# EasyEDA Pro project esp32s3_min_system.eprj

# Schematic Schematic1
Board Name: Board1; Create Date: 2025-03-25; Page Name: P1; Project Name: esp32s3_min_system; Schematic Name: Schematic1; Update Date: 2025-03-26; Company: EasyEDA.com; Page Size: A4; Version: V1.0
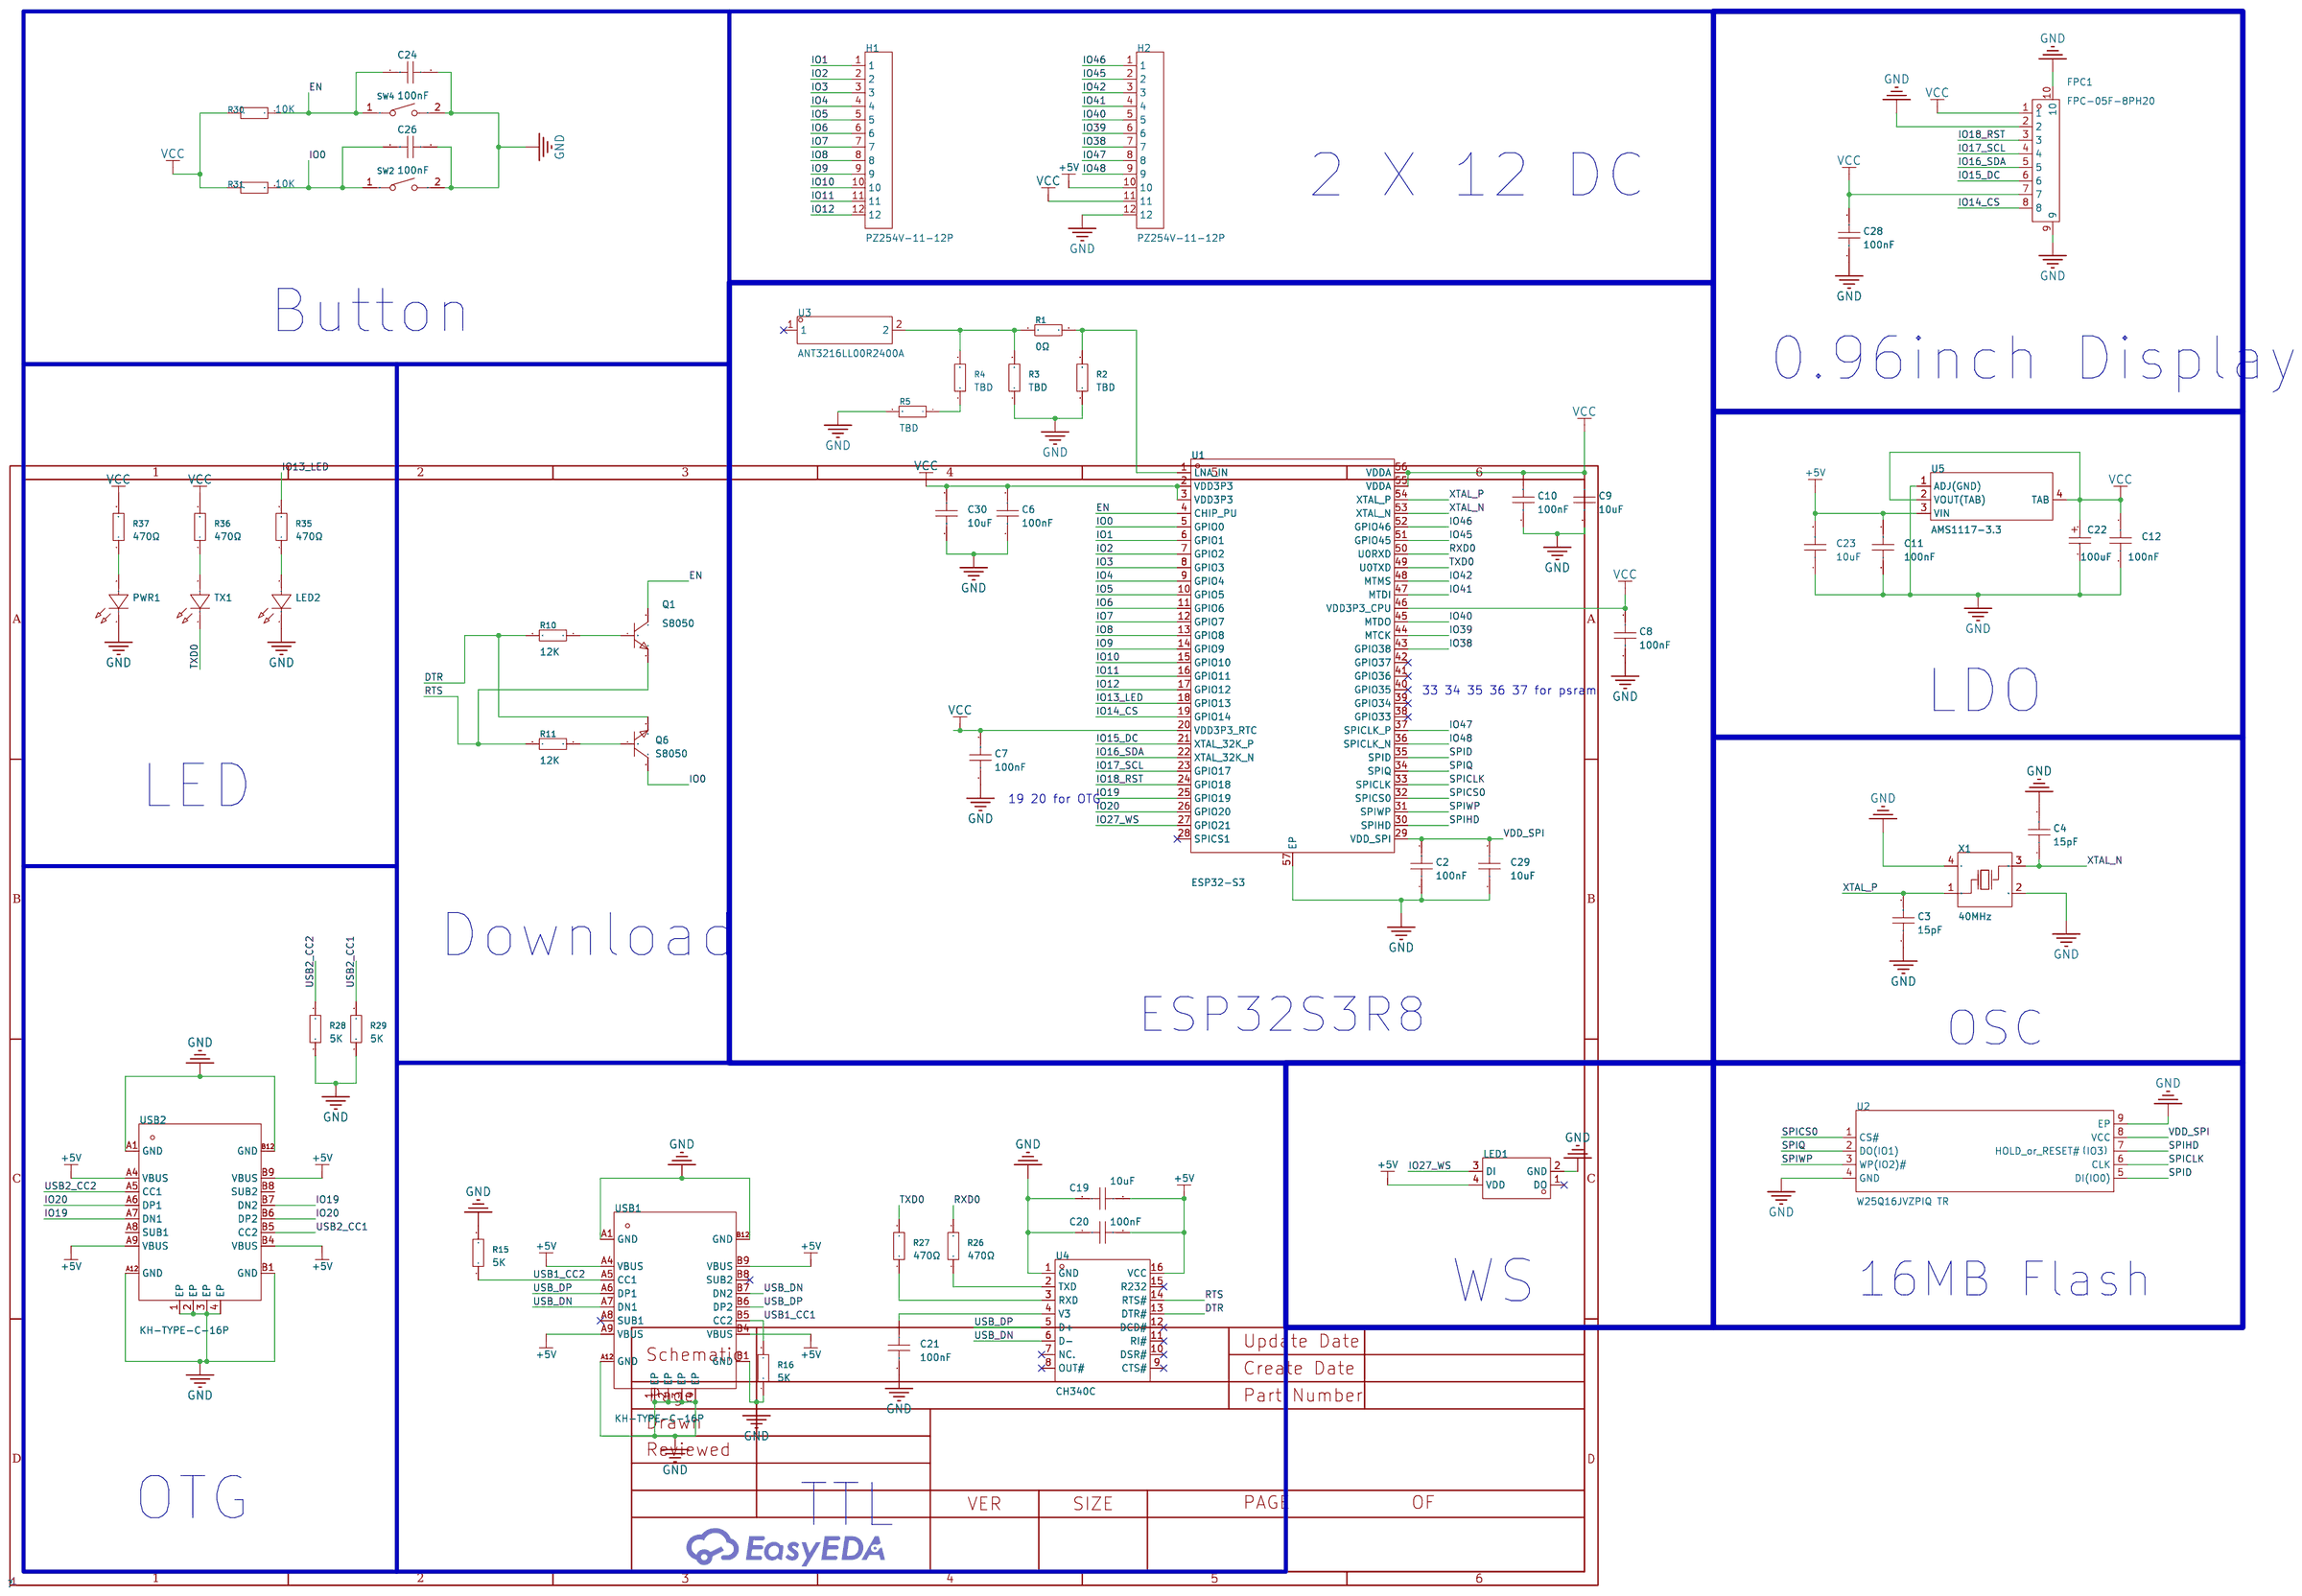
[diagram p0: schematic sheet]

## Parts
C2  100nF  [C0402]
C3  15pF  [C0402]
C4  15pF  [C0402]
C6  100nF  [C0402]
C7  100nF  [C0402]
C8  100nF  [C0402]
C9  10uF  [C0402]
C10  100nF  [C0402]
C11  100nF  [C0402]
C12  100nF  [C0402]
C19  10uF  [C0603]
C20  100nF  [C0402]
C21  100nF  [C0402]
C22  100uF  [CASE-B_3528]
C23  10uF  [C0603]
C24  100nF  [C0402]
C26  100nF  [C0402]
C28  100nF  [C0402]
C29  10uF  [C0603]
C30  10uF  [C0603]
FPC1  FPC-05F-8PH20  [FPC-SMD_8P-P0.50_FPC-05F-8PH20]
H1  PZ254V-11-12P  [HDR-TH_12P-P2.54-V-M]
H2  PZ254V-11-12P  [HDR-TH_12P-P2.54-V-M]
LED1  XL-2020RGBC-WS2812B  [LED-SMD_4P-L2.0-W2.0-BR-1]
LED2  XL-1608SURC-06  [LED0603-RD_RED]
PWR1  XL-1608SURC-06  [LED0603-RD_RED]
Q1  S8050  [SOT-23-3_L2.9-W1.3-P1.90-LS2.3-BR]
Q6  S8050  [SOT-23-3_L2.9-W1.3-P1.90-LS2.3-BR]
R1  0Ω  [R0402]
R2  TBD  [R0402]
R3  TBD  [R0402]
R4  TBD  [R0402]
R5  TBD  [R0402]
R10  12K  [R0402]
R11  12K  [R0402]
R15  5K  [R0402]
R16  5K  [R0402]
R26  470Ω  [R0402]
R27  470Ω  [R0402]
R28  5K  [R0402]
R29  5K  [R0402]
R30  10K  [R0402]
R31  10K  [R0402]
R35  470Ω  [R0402]
R36  470Ω  [R0402]
R37  470Ω  [R0402]
SW2  TS-1088-AR02016  [SW-SMD_L3.9-W3.0-P4.45]
SW4  TS-1088-AR02016  [SW-SMD_L3.9-W3.0-P4.45]
TX1  XL-1608SURC-06  [LED0603-RD_RED]
U1  ESP32-S3  [QFN-56_L7.0-W7.0-P0.40-TL-EP4.0]
U2  W25Q16JVZPIQ TR  [WSON-8_L6.0-W5.0-P1.27-BL-EP]
U3  ANT3216LL00R2400A  [ANT-SMD_L3.2-W1.6]
U4  CH340C  [SOP-16_L10.0-W3.9-P1.27-LS6.0-BL]
U5  AMS1117-3.3  [SOT-223-4_L6.5-W3.5-P2.30-LS7.0-BR]
USB1  KH-TYPE-C-16P  [USB-C-SMD_KH-TYPE-C-16P]
USB2  KH-TYPE-C-16P  [USB-C-SMD_KH-TYPE-C-16P]
X1  40MHz  [OSC-SMD_4P-L3.2-W2.5-BL_SIT8008BI]

## Library data of the parts
C2-C4 C6-C10 C28 = CL05A105KA5NQNC: LCSC Part Name: 1uF ±10% 25V; Supplier Part: C52923; Manufacturer: SAMSUNG(三星); Supplier Footprint: 0402; JLCPCB Part Class: Basic Part; Datasheet: https://atta.szlcsc.com/upload/public/pdf/source/20160218/1457707763339.pdf; Supplier: LCSC; Tolerance: ±10%
C11 C12 C20 C21 C24 C26 = CL05B104KO5NNNC: Capacitance: Tolerance:±10% Tolerance:±10% Voltage Rated: Temperature Coefficient:; LCSC Part Name: 100nF ±10% 16V; Supplier Part: C1525; Manufacturer: SAMSUNG(三星); Supplier Footprint: 0402; JLCPCB Part Class: Basic Part; Datasheet: https://atta.szlcsc.com/upload/public/pdf/source/20160218/1457707763339.pdf; Supplier: LCSC; Tolerance: ±10%
C19 C23 C29 C30 = CGA0603X5R106K100JT: Capacitance:10uF Tolerance:±10% Tolerance:±10% Voltage Rating:10V Temperature Coefficient:X5R; LCSC Part Name: 10uF ±10% 10V; Supplier Part: C6119842; Manufacturer: HRE(芯声); Supplier Footprint: 0603; JLCPCB Part Class: Extended Part; Supplier: LCSC; Tolerance: ±10%; Voltage Rating: 10V; Temperature Coefficient: X5R
C22 = TAJB107K006RNJ: Capacitance: Tolerance:±10% Tolerance:±10% Rated Voltage: Equivalent Series Resistance(ESR):1.7Ω@100kHz Operating Temperature:-55℃~+125℃ Operating Temperature:-55℃~+125℃; LCSC Part Name: 100uF ±10% 6.3V; Supplier Part: C16133; Manufacturer: Kyocera AVX; Supplier Footprint: CASE-B-3528-21(mm); JLCPCB Part Class: Basic Part; Datasheet: https://atta.szlcsc.com/upload/public/pdf/source/20160107/1457707750344.pdf; Supplier: LCSC; Tolerance: ±10%; Equivalent Series Resistance(ESR): 1.7Ω@100kHz; Operating Temperature: -55℃~+125℃
FPC1 = FPC-05F-8PH20: LCSC Part Name: 间距:0.5mm P数:8P 翻盖式 下接; Supplier Part: C2856797; Manufacturer: XUNPU(讯普); Supplier Footprint: SMD,P=0.5mm,卧贴; JLCPCB Part Class: Extended Part; Datasheet: https://atta.szlcsc.com/upload/public/pdf/source/20210728/C2856796_EA80EFD10E16055FE067E7763B90421F.pdf; Supplier: LCSC; Locking Feature: Clamshell; Contact Type: Bottom Contact; Number of Contacts: 8P; Pitch: 0.5mm; Mounting Type: 卧贴; FFC, FCB Thickness: 0.3mm; Height Above Board: 2mm; Operating Temperature Range: -25℃~+85℃
H1 H2 = PZ254V-11-12P: LCSC Part Name: 1x12P 间距:2.54mm 方针 直插; Supplier Part: C2840012; Manufacturer: XFCN(兴飞); Supplier Footprint: 插件,P=2.54mm; JLCPCB Part Class: Extended Part; Datasheet: https://atta.szlcsc.com/upload/public/pdf/source/20200309/C492403_F9F19131791D08044AD4F84F8E751A34.pdf; Supplier: LCSC; Pin Structure: 1x12P; Pitch: 2.54mm; Circluar Pins/Square Pins: Policy; Mounting Type: Straight; Number of Rows: Single Row; Number of Pins: 12P; Current Rating: 3A; Voltage Rating (Max): 250V; Length of Mating Pin: 6mm; Insulation Height: 2.5mm; Length of End Connection Pin: 3mm; Operating Temperature: -40℃~+105℃; Color: Black
LED1 = XL-2020RGBC-WS2812B: Wavelength:620nm~625nm；470nm~475nm；525nm~530nm Luminous Intensity:150mcd；150mcd；400mcd Lens Color:Translucent Fog Lens Installation method:Positive Stick Operating Temperature:-20℃~+85℃; LCSC Part Name: 幻彩透明; Supplier Part: C5349955; Manufacturer: XINGLIGHT(成兴光); Supplier Footprint: 2020; JLCPCB Part Class: Extended Part; Datasheet: https://atta.szlcsc.com/upload/public/pdf/source/20230111/97A2D5930F183799801175706AF118AF.pdf; Supplier: LCSC; Wavelength: 620nm~625nm；470nm~475nm；525nm~530nm; Luminous Intensity: 150mcd；150mcd；400mcd; Lens Color: Translucent Fog Lens; Installation method: Positive Stick; Operating Temperature: -20℃~+85℃
LED2 PWR1 TX1 = XL-1608SURC-06: Lamp Holder Type:- Illumination Color:Red Voltage - Forward(Vf):2.3V Voltage - Forward(Vf):2.3V Power(Watts):50mW Forward Current:20mA Wavelength - Dominant:620nm~630nm Wavelength - Dominant:620nm~630nm Peak Wavelength:625nm Diode Configuration:- Lens Col; Supplier Part: C965799; Manufacturer: XINGLIGHT(成兴光); Supplier Footprint: 0603; JLCPCB Part Class: Extended Part; Datasheet: https://atta.szlcsc.com/upload/public/pdf/source/20250213/F9766CE804AF391355DCDD48DB3E0DAB.pdf; Supplier: LCSC; Illumination Color: Red; Voltage - Forward(Vf): 2.3V; Power(Watts): 50mW; Forward Current: 20mA; Wavelength - Dominant: 620nm~630nm; Peak Wavelength: 625nm; Lens Color: Colorless Transparent Lens; Luminous Intensity: 225mcd; Viewing Angle: 120°; Mounting Sytle: Positive Stick; Operating Temperature: -20℃~+85℃
Q1 Q6 = S8050_C20069125: type:NPN Current - Collector(Ic): Collector - Emitter Voltage VCEO: Pd - Power Dissipation:300mW DC Current Gain:120@50mA,1.0V DC Current Gain:120@50mA,1.0V Transition frequency(fT):100MHz Current - Collector Cutoff:100nA Vce Saturation(VCE(sat)):600mV Op; LCSC Part Name: hFE:200-350，丝印:J3Y S8050; Supplier Part: C20069125; Manufacturer: 宏嘉诚; Supplier Footprint: SOT-23; JLCPCB Part Class: Extended Part; Datasheet: https://atta.szlcsc.com/upload/public/pdf/source/20250107/343E8B94B5C24D0D65D7D4B70E0B73F6.pdf; Supplier: LCSC; type: NPN; Pd - Power Dissipation: 300mW; DC Current Gain: 120@50mA,1.0V; Transition frequency(fT): 100MHz; Current - Collector Cutoff: 100nA; Vce Saturation(VCE(sat)): 600mV; Operating Temperature: -55℃~+150℃
R1-R5 = 0402WGF0000TCE: LCSC Part Name: 0Ω ±1% 62.5mW 厚膜电阻; Supplier Part: C17168; Manufacturer: UNI-ROYAL(厚声); Supplier Footprint: 0402; JLCPCB Part Class: Basic Part; Datasheet: https://atta.szlcsc.com/upload/public/pdf/source/20200306/C422600_1E6D84923E4A46A82E41ADD87F860B5C.pdf; Supplier: LCSC; Type: Thick Film Resistors; Tolerance: ±1%; Temperature Coefficient: ±800ppm/℃; Operating Temperature Range: -55℃~+155℃
R10 R11 R15 R16 R26-R31 R35-R37 = 0402WGF4700TCE: Type:Thick Film Resistors Resistance: Tolerance:±1% Tolerance:±1% Power(Watts): Overload Voltage (Max): Temperature Coefficient:±100ppm/℃ Temperature Coefficient:±100ppm/℃ Operating Temperature Range:-55℃~+155℃ Operating Temperature Range:-55℃~+155℃; LCSC Part Name: 470Ω ±1% 62.5mW 厚膜电阻; Supplier Part: C25117; Manufacturer: UNI-ROYAL(厚声); Supplier Footprint: 0402; JLCPCB Part Class: Basic Part; Datasheet: https://atta.szlcsc.com/upload/public/pdf/source/20200306/C422600_1E6D84923E4A46A82E41ADD87F860B5C.pdf; Supplier: LCSC; Type: Thick Film Resistors; Tolerance: ±1%; Temperature Coefficient: ±100ppm/℃; Operating Temperature Range: -55℃~+155℃
SW2 SW4 = TS-1088-AR02016: Circuit:SPST Actuator Style:Round Button Operating Force:160gf Mounting Style:Brick nogging Switch Length:4mm Switch Width:3mm Switch Height:2mm Strike Gundam:不带 Contact Current:50mA Voltage Rating (DC):12V Insulation Resistance:100MΩ Actuator/Cap Color:B; LCSC Part Name: 4*3*2mm 立贴 轻触开关; Supplier Part: C720477; Manufacturer: XUNPU(讯普); Supplier Footprint: SMD; JLCPCB Part Class: Extended Part; Datasheet: https://atta.szlcsc.com/upload/public/pdf/source/20200810/C720475_60D09DD6C54279ADDB2DC25100F1CC11.pdf; Supplier: LCSC; Circuit: SPST; Actuator Style: Round Button; Operating Force: 160gf; Mounting Style: Brick nogging; Switch Length: 4mm; Switch Width: 3mm; Switch Height: 2mm; Strike Gundam: 不带; Contact Current: 50mA; Voltage Rating (DC): 12V; Insulation Resistance: 100MΩ; Actuator/Cap Color: Black; Pin Style: SMDSplicing; Mechanical Life: 10万次; Operating Temperature: -30℃~+80℃
U1 = ESP32-S3: LCSC Part Name: 支持2.4GHz WIFI和低功耗蓝牙的MCU SoC; Supplier Part: C2913192; Manufacturer: ESPRESSIF(乐鑫); Supplier Footprint: QFN-56-EP(7x7); JLCPCB Part Class: Extended Part; Datasheet: https://atta.szlcsc.com/upload/public/pdf/source/20241030/3428D9BCA56E860957850BFAF37EAC62.pdf; Supplier: LCSC; Frequency Range: 2412MHz~2484MHz; Interface: ADC,GPIO,I2C,I2S,PWM,SPI,UART,USB; Operating Voltage: 3V~3.6V; Applications: WiFi；IoT; Output Power: 21dBm; Data Rate: 150Mbps; Current Of Transmitting: 340mA; Sensitivity: -98.4dBm; Receive Current: 88mA; Typical Application Frequency: 2.4GHz; Operating Temperature: -40℃~+105℃
U2 = W25Q16JVZPIQ TR: Supplier Part: C2456208; Manufacturer: WINBOND(华邦); Supplier Footprint: WSON-8-EP(5x6); JLCPCB Part Class: Extended Part; Datasheet: https://atta.szlcsc.com/upload/public/pdf/source/20190529/C115407_78E5B4F96E7138D299EC51EC5982A1A5.pdf; Supplier: LCSC
U3 = ANT3216LL00R2400A: LCSC Part Name: 无线组件陶瓷芯片天线; Supplier Part: C293767; Manufacturer: YAGEO(国巨); Supplier Footprint: 1206; JLCPCB Part Class: Extended Part; Datasheet: https://atta.szlcsc.com/upload/public/pdf/source/20181012/C293767_CDE82A2F74DC82A94DB708CB53B68F23.pdf; Supplier: LCSC; Antenna Type: Chip Antenna; Central Frequency: 2450MHz; Bandwidth: 160MHz; Peak Gain: 5.05dBi; Polarization Type: Linear; Impedance: 50Ω; Power capacity: 1W; Operating Temperature: -40℃~+105℃
U4 = CH340C: Applications Function:Transceiver Protocol: Supply Voltage:3.3V；5V Supply Voltage:3.3V；5V Data Rate:2Mbps; LCSC Part Name: CH340C USB转串口芯片 CH340; Supplier Part: C84681; Manufacturer: WCH(南京沁恒); Supplier Footprint: SOP-16; JLCPCB Part Class: Extended Part; Datasheet: https://atta.szlcsc.com/upload/public/pdf/source/20240619/63986D8440D4E5267A77ACD891CC4DE3.pdf; Supplier: LCSC; Applications Function: Transceiver; Supply Voltage: 3.3V；5V; Data Rate: 2Mbps
U5 = AMS1117-3.3_C347222: Output Type:Fixed Voltage - Supply:12V Output Voltage:3.3V Output Voltage:3.3V Output Current:1A Power Supply Rejection Ratio (PSRR):60dB@(120Hz) Voltage Dropout:1.3V@(1A) standby current:- Noise:- Features:Overcurrent Protection Operating Temperature:- O; LCSC Part Name: 输出:3.3V 电流:1A 耐压:12V; Supplier Part: C347222; Manufacturer: UMW(友台半导体); Supplier Footprint: SOT-223; JLCPCB Part Class: Extended Part; Datasheet: https://atta.szlcsc.com/upload/public/pdf/source/20241218/BAF0263FA2E44BCD8AF41AA4FA04EFAA.pdf; Supplier: LCSC; Output Type: Fixed; Voltage - Supply: 12V; Output Voltage: 3.3V; Output Current: 1A; Power Supply Rejection Ratio (PSRR): 60dB@(120Hz); Voltage Dropout: 1.3V@(1A); Features: Overcurrent Protection; Output Configuration: Positive electrode; Number of Outputs: 1
USB1 USB2 = KH-TYPE-C-16P: Connector Type:Type-C Standard:- Gender:Female Number of Ports:1 Number of Contacts:16P Mounting Style:卧贴 Current Rating - Power (Max):3A Operating Temperature Range:-40℃~+85℃ Operating Temperature Range:-40℃~+85℃; LCSC Part Name: Type-C 母 卧贴; Supplier Part: C709357; Manufacturer: kinghelm(金航标); Supplier Footprint: SMD; JLCPCB Part Class: Extended Part; Datasheet: https://atta.szlcsc.com/upload/public/pdf/source/20200911/C709357_AA8DCEB38BB20E3035A7ED7AE7667837.pdf; Supplier: LCSC; Connector Type: Type-C; Gender: Female; Number of Ports: 1; Number of Contacts: 16P; Mounting Style: 卧贴; Current Rating - Power (Max): 3A; Operating Temperature Range: -40℃~+85℃
X1 = X322540MPB4SI: LCSC Part Name: 40MHz ±10ppm 15pF; Supplier Part: C9010; Manufacturer: YXC(扬兴晶振); Supplier Footprint: SMD3225-4P; JLCPCB Part Class: Extended Part; Datasheet: https://atta.szlcsc.com/upload/public/pdf/source/20240329/19D5F850207469550BEB00D7DFEDBC7A.pdf; Supplier: LCSC; Crystal Type: Surface Mount Crystal; Normal temperature Frequency Tolerance: ±10ppm; Frequency Stability(Full temperature range): ±20ppm

## Nets
+5V: C11.1 C19.1 C20.2 C23.2 H2.10 LED1.4(VDD) U4.16(VCC) U5.3(VIN) USB1.A4(VBUS) USB1.A9(VBUS) USB1.B4(VBUS) USB1.B9(VBUS) USB2.A4(VBUS) USB2.A9(VBUS) USB2.B4(VBUS) USB2.B9(VBUS)
GND: C2.1 C3.1 C4.2 C6.1 C7.1 C8.1 C9.1 C10.1 C11.2 C12.2 C19.2 C20.1 C21.1 C22.2 C23.1 C24.2 C26.1 C28.1 C29.1 C30.1 FPC1.2 FPC1.9 FPC1.10 H2.12 LED1.2(GND) LED2.1(K) PWR1.1(K) R2.1 R3.1 R5.2 R15.2 R16.1 R28.1 R29.1 SW2.2 SW4.2 U1.57(EP) U2.4(GND) U2.9(EP) U4.1(GND) U5.1(ADJ(GND)) USB1.1(EP) USB1.2(EP) USB1.3(EP) USB1.4(EP) USB1.A1(GND) USB1.A12(GND) USB1.B1(GND) USB1.B12(GND) USB2.1(EP) USB2.2(EP) USB2.3(EP) USB2.4(EP) USB2.A1(GND) USB2.A12(GND) USB2.B1(GND) USB2.B12(GND) X1.2(GND) X1.4(GND)
VCC: C6.2 C7.2 C8.2 C9.2 C10.2 C12.1 C22.1 C28.2 C30.2 FPC1.1 FPC1.7 H2.11 R30.2 R31.2 R36.2 R37.2 U1.2(VDD3P3) U1.3(VDD3P3) U1.20(VDD3P3_RTC) U1.46(VDD3P3_CPU) U1.55(VDDA) U1.56(VDDA) U5.2(VOUT(TAB)) U5.4(TAB)
VDD_SPI: C2.2 C29.2 U1.29(VDD_SPI) U2.8(VCC)
DTR: Q6.2(E) R10.2 U4.13(DTR#)
EN: C24.1 Q1.3(C) R30.1 SW4.1 U1.4(CHIP_PU)
IO0: C26.2 Q6.3(C) R31.1 SW2.1 U1.5(GPIO0)
IO1: H1.1 U1.6(GPIO1)
IO2: H1.2 U1.7(GPIO2)
IO3: H1.3 U1.8(GPIO3)
IO4: H1.4 U1.9(GPIO4)
IO5: H1.5 U1.10(GPIO5)
IO6: H1.6 U1.11(GPIO6)
IO7: H1.7 U1.12(GPIO7)
IO8: H1.8 U1.13(GPIO8)
IO9: H1.9 U1.14(GPIO9)
IO10: H1.10 U1.15(GPIO10)
IO11: H1.11 U1.16(GPIO11)
IO12: H1.12 U1.17(GPIO12)
IO13_LED: R35.2 U1.18(GPIO13)
IO14_CS: FPC1.8 U1.19(GPIO14)
IO15_DC: FPC1.6 U1.21(XTAL_32K_P)
IO16_SDA: FPC1.5 U1.22(XTAL_32K_N)
IO17_SCL: FPC1.4 U1.23(GPIO17)
IO18_RST: FPC1.3 U1.24(GPIO18)
IO19: U1.25(GPIO19) USB2.A7(DN1) USB2.B7(DN2)
IO20: U1.26(GPIO20) USB2.A6(DP1) USB2.B6(DP2)
IO27_WS: LED1.3(DI) U1.27(GPIO21)
IO38: H2.7 U1.43(GPIO38)
IO39: H2.6 U1.44(MTCK)
IO40: H2.5 U1.45(MTDO)
IO41: H2.4 U1.47(MTDI)
IO42: H2.3 U1.48(MTMS)
IO45: H2.2 U1.51(GPIO45)
IO46: H2.1 U1.52(GPIO46)
IO47: H2.8 U1.37(SPICLK_P)
IO48: H2.9 U1.36(SPICLK_N)
RTS: Q1.2(E) R11.2 U4.14(RTS#)
RXD0: R26.2 U1.50(U0RXD)
SPICLK: U1.33(SPICLK) U2.6(CLK)
SPICS0: U1.32(SPICS0) U2.1(CS#)
SPID: U1.35(SPID) U2.5(DI(IO0))
SPIHD: U1.30(SPIHD) U2.7(HOLD or RESET#（IO3）)
SPIQ: U1.34(SPIQ) U2.2(DO(IO1))
SPIWP: U1.31(SPIWP) U2.3(WP(IO2)#)
TXD0: R27.2 TX1.1(K) U1.49(U0TXD)
USB1_CC1: R16.2 USB1.B5(CC2)
USB1_CC2: R15.1 USB1.A5(CC1)
USB2_CC1: R29.2 USB2.B5(CC2)
USB2_CC2: R28.2 USB2.A5(CC1)
USB_DN: U4.6(D-) USB1.A7(DN1) USB1.B7(DN2)
USB_DP: U4.5(D+) USB1.A6(DP1) USB1.B6(DP2)
XTAL_N: C4.1 U1.53(XTAL_N) X1.3(OSC2)
XTAL_P: C3.2 U1.54(XTAL_P) X1.1(OSC1)
$1N1315: R1.2 R2.2 U1.1(LNA_IN)
$1N1324: R1.1 R3.2 R4.2 U3.2
$1N1499: R4.1 R5.1
$1N3141: R26.1 U4.2(TXD)
$1N3142: R27.1 U4.3(RXD)
$1N3147: C21.2 U4.4(V3)
$1N3183: Q1.1(B) R10.1
$1N3184: Q6.1(B) R11.1
Net-(LED2-2): LED2.2(A) R35.1
Net-(PWR1-2): PWR1.2(A) R37.1
Net-(R36-1): R36.1 TX1.2(A)

Not connected (* = marked no-connect by the designer): LED1 1(DO)*; U1 28(SPICS1)* 38(GPIO33)* 39(GPIO34)* 40(GPIO35)* 41(GPIO36)* 42(GPIO37)*; U3 1*; U4 7(NC.)* 8(OUT#)* 9(CTS#)* 10(DSR#)* 11(RI#)* 12(DCD#)* 15(R232)*; USB1 A8(SUB1)* B8(SUB2)*; USB2 A8(SUB1) B8(SUB2)

## Notes on the sheet
- 2 X 12 DC
- Button
- 0.96inch Display
- 33 34 35 36 37 for psram
- LDO
- LED
- 19 20 for OTG
- Download
- ESP32S3R8
- OSC
- 16MB Flash
- WS
- OTG
- TTL

# Board PCB1
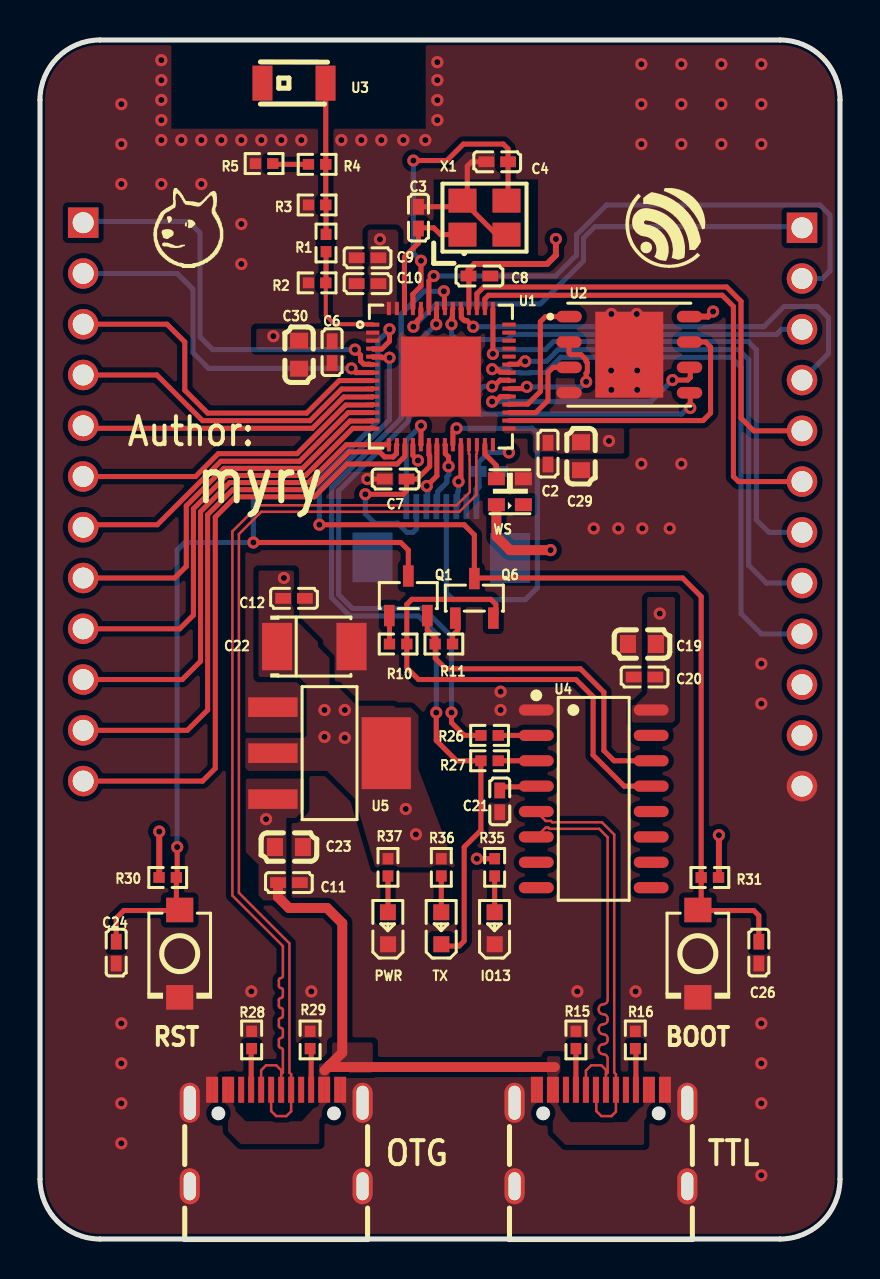
[diagram p1: board, top side]
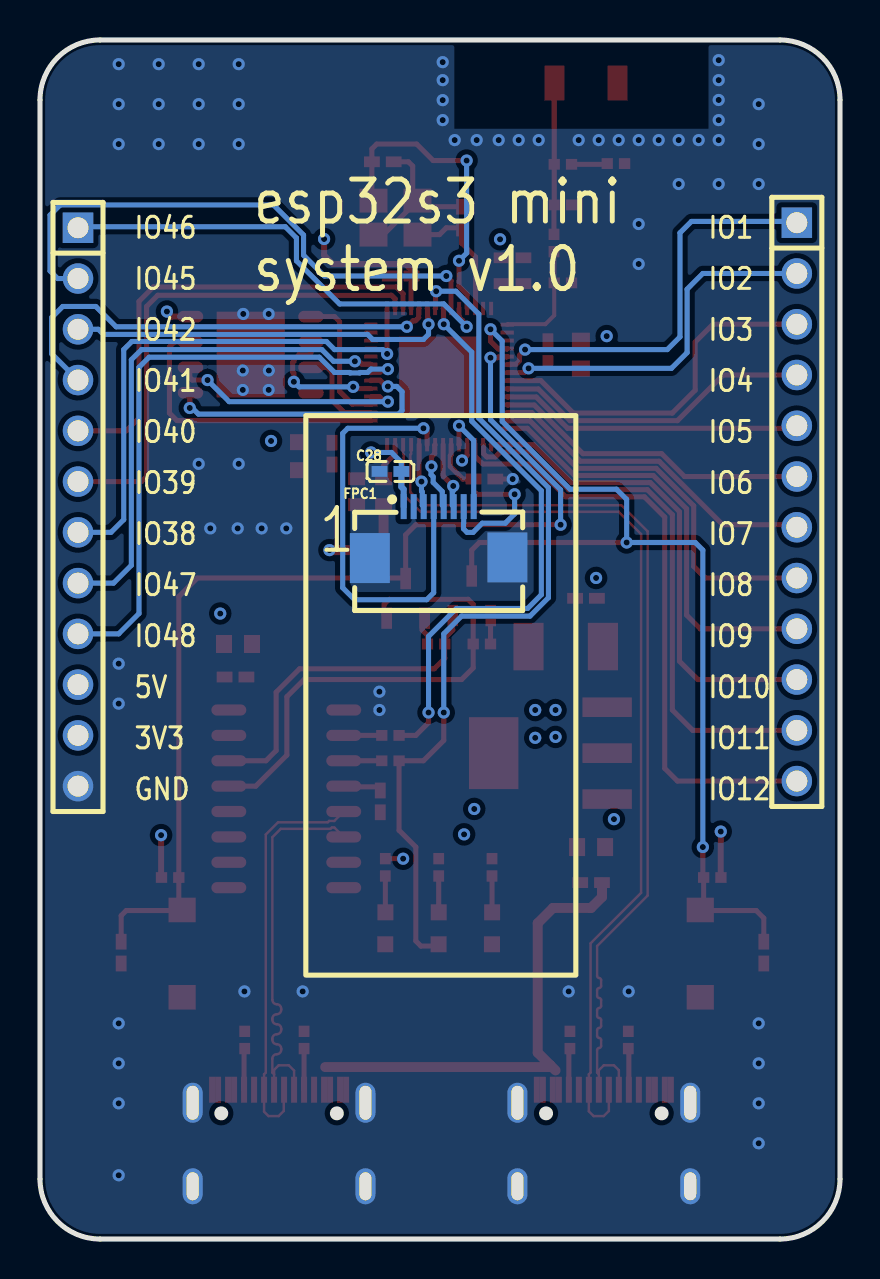
[diagram p2: board, bottom side, seen from below]

Outline 40 x 60 mm; copper layers: Top Layer, GND, PWR, Bottom Layer. Coordinates in mm from the lower left corner of the outline.
Outline path: 0,57 0,3 arc(0.88,0.88) 3,0 37,0 arc(39.12,0.88) 40,3 40,57 arc(39.12,59.12) 37,60 3,60 arc(0.88,59.12) 0,57
Stack: Top Layer 0.035mm Outer layer copper thickness 1oz / Dielectric1 0.2104mm 7628 RC49% 8.6mil / GND 0.0152mm Inner layer copper thickness / Dielectric2 1.065mm 1.1mm H/HOZ Copper / PWR 0.0152mm Inner layer copper thickness / Dielectric3 0.2104mm 7628 RC49% 8.6mil / Bottom Layer 0.035mm Outer layer copper thickness 1oz

## Design rules (mm)
net IO19: DP2
net IO20: DP2
net USB_DP: DP1
net USB_DN: DP1
template: Custom Config
spacing copperThickness1oz (default): track to track 0.102, other pairs 0.152 to 0.3
spacing copperThickness2oz: track to track 0.203, other pairs 0.152 to 0.3
track width copperThickness1oz (default): min 0.127, default 0.254, max 2.54
track width copperThickness2oz: min 0.203, default 0.254, max 2.54
differential pair differentialPair (default): width min 0.124, default 0.124, max 0.124; gap min 0.203, default 0.203
via viaSize (default): diameter min 0.5, default 0.61, max 10; hole min 0.3, default 0.305, max 6.3

## Placement (name value [footprint] x y rotation side)
BOOT  TS-1088-AR02016  [SW-SMD_L3.9-W3.0-P4.45]  32.89 14.28 270 top
C2  100nF  [C0402]  25.4 39.3 90 top
C3  15pF  [C0402]  18.92 51.11 270 top
C4  15pF  [C0402]  22.86 53.9 180 top
C6  100nF  [C0402]  14.6 44.38 90 top
C7  100nF  [C0402]  17.78 38.03 0 top
C8  100nF  [C0402]  21.97 48.19 180 top
C9  10uF  [C0402]  16.38 49.1 0 top
C10  100nF  [C0402]  16.38 47.81 0 top
C11  100nF  [C0402]  12.45 17.84 0 top
C12  100nF  [C0402]  12.7 32.06 0 top
C19  10uF  [C0603]  30.1 29.77 180 top
C20  100nF  [C0402]  30.23 28.12 0 top
C21  100nF  [C0402]  22.99 21.9 90 top
C22  100uF  [CASE-B_3528]  13.72 29.65 0 top
C23  10uF  [C0603]  12.45 19.61 180 top
C24  100nF  [C0402]  3.81 14.33 270 top
C26  100nF  [C0402]  35.94 14.33 90 top
C28  100nF  [C0402]  22.48 38.41 180 bottom
C29  10uF  [C0603]  27.05 39.17 90 top
C30  10uF  [C0603]  12.95 44.25 90 top
FPC1  FPC-05F-8PH20  [FPC-SMD_8P-P0.50_FPC-05F-8PH20]  20.07 35.36 180 bottom
H1  PZ254V-11-12P  [HDR-TH_12P-P2.54-V-M]  2.16 36.89 270 bottom
H2  PZ254V-11-12P  [HDR-TH_12P-P2.54-V-M]  38.1 36.63 270 bottom
IO13  XL-1608SURC-06  [LED0603-RD_RED]  22.73 15.55 90 top
OTG  KH-TYPE-C-16P  [USB-C-SMD_KH-TYPE-C-16P]  11.81 5.05 0 top
PWR  XL-1608SURC-06  [LED0603-RD_RED]  17.4 15.55 90 top
Q1  S8050  [SOT-23-3_L2.9-W1.3-P1.90-LS2.3-BR]  18.41 32.19 270 top
Q6  S8050  [SOT-23-3_L2.9-W1.3-P1.90-LS2.3-BR]  21.72 32.06 270 top
R1  0Ω  [R0402]  14.3 49.84 270 top
R2  TBD  [R0402]  13.86 47.85 0 top
R3  TBD  [R0402]  13.86 51.74 0 top
R4  TBD  [R0402]  13.86 53.78 0 top
R5  TBD  [R0402]  11.2 53.82 180 top
R10  12K  [R0402]  17.91 29.77 0 top
R11  12K  [R0402]  20.19 29.77 180 top
R15  5K  [R0402]  26.8 9.96 90 top
R16  5K  [R0402]  29.77 9.96 270 top
R26  470Ω  [R0402]  22.48 25.2 180 top
R27  470Ω  [R0402]  22.48 23.93 180 top
R28  5K  [R0402]  10.58 9.96 270 top
R29  5K  [R0402]  13.5 9.96 270 top
R30  10K  [R0402]  6.39 18.09 180 top
R31  10K  [R0402]  33.49 18.09 0 top
R35  470Ω  [R0402]  22.73 18.6 90 top
R36  470Ω  [R0402]  20.07 18.6 90 top
R37  470Ω  [R0402]  17.4 18.6 90 top
RST  TS-1088-AR02016  [SW-SMD_L3.9-W3.0-P4.45]  6.99 14.28 270 top
TTL  KH-TYPE-C-16P  [USB-C-SMD_KH-TYPE-C-16P]  28.05 5.05 0 top
TX  XL-1608SURC-06  [LED0603-RD_RED]  20.07 15.55 90 top
U1  ESP32-S3  [QFN-56_L7.0-W7.0-P0.40-TL-EP4.0]  20.04 43.16 0 top
U2  W25Q16JVZPIQ TR  [WSON-8_L6.0-W5.0-P1.27-BL-EP]  29.46 44.25 270 top
U3  ANT3216LL00R2400A  [ANT-SMD_L3.2-W1.6]  12.7 57.84 0 top
U4  CH340C  [SOP-16_L10.0-W3.9-P1.27-LS6.0-BL]  27.69 22.03 270 top
U5  AMS1117-3.3  [SOT-223-4_L6.5-W3.5-P2.30-LS7.0-BR]  14.48 24.31 180 top
WS  XL-2020RGBC-WS2812B  [LED-SMD_4P-L2.0-W2.0-BR-1]  23.5 37.39 0 top
X1  40MHz  [OSC-SMD_4P-L3.2-W2.5-BL_SIT8008BI]  22.22 51.11 0 top

## Footprints (pads in the part's own frame, mm; a bottom-side part is the same pattern mirrored in y, then rotated)
ANT-SMD_L3.2-W1.6
  rect 1x1.75 smd: 1(-1.578,0) 2(1.578,0)
C0402
  rect 0.79x0.54 smd: 1(-0.545,0) 2(0.545,0)
C0603
  rect 0.8x0.9 smd: 1(-0.7,0) 2(0.7,0)
CASE-B_3528
  rect 1.506x2.376 smd: 1(-1.861,0) 2(1.861,0)
FPC-SMD_8P-P0.50_FPC-05F-8PH20
  rect 0.3x1.25 smd: 1(-1.75,1.288) 2(-1.25,1.288) 3(-0.75,1.288) 4(-0.25,1.288) 5(0.25,1.288) 6(0.75,1.288) 7(1.25,1.288) 8(1.75,1.288)
  rect 2x2.5 smd: 9(3.44,-1.252) 10(-3.44,-1.288)
HDR-TH_12P-P2.54-V-M
  rect 1.524x1.524 hole 1.05: 1(-13.97,0)
  round 1.524 hole 1.05: 2(-11.43,0) 3(-8.89,0) 4(-6.35,0) 5(-3.81,0) 6(-1.27,0) 7(1.27,0) 8(3.81,0) 9(6.35,0) 10(8.89,0) 11(11.43,0) 12(13.97,0)
LED0603-RD_RED
  rect 0.8x0.8 smd: 1(-0.799,-0.004) 2(0.799,0.004)
LED-SMD_4P-L2.0-W2.0-BR-1
  rect 0.85x0.65 smd: 1(0.675,-0.65) 2(0.675,0.65) 3(-0.675,0.65) 4(-0.675,-0.65)
OSC-SMD_4P-L3.2-W2.5-BL_SIT8008BI
  rect 1.4x1.2 smd: 1(-1.1,-0.85) 2(1.1,-0.85) 3(1.1,0.85) 4(-1.1,0.85)
QFN-56_L7.0-W7.0-P0.40-TL-EP4.0
  rect 0.665x0.2 smd: 1(-3.408,2.6) 2(-3.408,2.2) 3(-3.408,1.8) 4(-3.408,1.4) 5(-3.408,1) 6(-3.408,0.6) 7(-3.408,0.2) 8(-3.408,-0.2) 9(-3.408,-0.6) 10(-3.408,-1) 11(-3.408,-1.4) 12(-3.408,-1.8) 13(-3.408,-2.2) 14(-3.408,-2.6) 29(3.408,-2.6) 30(3.408,-2.2) 31(3.408,-1.8) 32(3.408,-1.4) 33(3.408,-1) 34(3.408,-0.6) 35(3.408,-0.2) 36(3.408,0.2) 37(3.408,0.6) 38(3.408,1) 39(3.408,1.4) 40(3.408,1.8) 41(3.408,2.2) 42(3.408,2.6)
  rect 0.2x0.665 smd: 15(-2.6,-3.408) 16(-2.2,-3.408) 17(-1.8,-3.408) 18(-1.4,-3.408) 19(-1,-3.408) 20(-0.6,-3.408) 21(-0.2,-3.408) 22(0.2,-3.408) 23(0.6,-3.408) 24(1,-3.408) 25(1.4,-3.408) 26(1.8,-3.408) 27(2.2,-3.408) 28(2.6,-3.408) 43(2.6,3.408) 44(2.2,3.408) 45(1.8,3.408) 46(1.4,3.408) 47(1,3.408) 48(0.6,3.408) 49(0.2,3.408) 50(-0.2,3.408) 51(-0.6,3.408) 52(-1,3.408) 53(-1.4,3.408) 54(-1.8,3.408) 55(-2.2,3.408) 56(-2.6,3.408)
  rect 4x4 smd: 57(0,0)
R0402
  rect 0.566x0.54 smd: 1(-0.433,0) 2(0.433,0)
SOP-16_L10.0-W3.9-P1.27-LS6.0-BL
  oval 0.56x1.745 smd: 1(-4.445,-2.873) 2(-3.175,-2.873) 3(-1.905,-2.873) 4(-0.635,-2.873) 5(0.635,-2.873) 6(1.905,-2.873) 7(3.175,-2.873) 8(4.445,-2.873) 9(4.445,2.873) 10(3.175,2.873) 11(1.905,2.873) 12(0.635,2.873) 13(-0.635,2.873) 14(-1.905,2.873) 15(-3.175,2.873) 16(-4.445,2.873)
SOT-23-3_L2.9-W1.3-P1.90-LS2.3-BR
  rect 1.07x0.532 smd: 1(0.99,-0.95) 2(0.99,0.95) 3(-0.99,0)
SOT-223-4_L6.5-W3.5-P2.30-LS7.0-BR
  rect 2.47x0.98 smd: 1(2.835,-2.3) 2(2.835,0) 3(2.835,2.3)
  rect 2.47x3.6 smd: 4(-2.835,0)
SW-SMD_L3.9-W3.0-P4.45
  rect 1.23x1.36 smd: 1(-2.185,0) 2(2.185,0)
USB-C-SMD_KH-TYPE-C-16P
  oval 1x2 hole 0.6x1.7: 1(-4.32,1.765) 2(4.32,1.765)
  oval 1x1.8 hole 0.6x1.4: 3(-4.32,-2.415) 4(4.32,-2.415)
  rect 0.3x1.3 smd: A1(-3.35,2.415) A4(-2.55,2.415) A5(-1.25,2.415) A6(-0.25,2.415) A7(0.25,2.415) A8(1.25,2.415) A9(2.55,2.415) A12(3.35,2.415) B1(3.05,2.415) B4(2.25,2.415) B5(1.75,2.415) B6(0.75,2.415) B7(-0.75,2.415) B8(-1.75,2.415) B9(-2.25,2.415) B12(-3.05,2.415)
WSON-8_L6.0-W5.0-P1.27-BL-EP
  oval 0.581x1.276 smd: 1(-1.905,-3.013) 2(-0.635,-3.013) 3(0.635,-3.013) 4(1.905,-3.013) 5(1.905,3.013) 6(0.635,3.013) 7(-0.635,3.013) 8(-1.905,3.013)
  rect 4.3x3.4 smd: 9(0,0)

## Nets
+5V: C11.1 C19.1 C20.2 C23.2 H2.10 OTG.A4 OTG.A9 OTG.B4 OTG.B9 TTL.A4 TTL.A9 TTL.B4 TTL.B9 U4.16 U5.3 WS.4
GND: BOOT.2 C2.1 C3.1 C4.2 C6.1 C7.1 C8.1 C9.1 C10.1 C11.2 C12.2 C19.2 C20.1 C21.1 C22.2 C23.1 C24.2 C26.1 C28.1 C29.1 C30.1 FPC1.2 FPC1.9 FPC1.10 H2.12 IO13.1 OTG.1 OTG.2 OTG.3 OTG.4 OTG.A1 OTG.A12 OTG.B1 OTG.B12 PWR.1 R2.1 R3.1 R5.2 R15.2 R16.1 R28.1 R29.1 RST.2 TTL.1 TTL.2 TTL.3 TTL.4 TTL.A1 TTL.A12 TTL.B1 TTL.B12 U1.57 U2.4 U2.9 U4.1 U5.1 WS.2 X1.2 X1.4
VCC: C6.2 C7.2 C8.2 C9.2 C10.2 C12.1 C22.1 C28.2 C30.2 FPC1.1 FPC1.7 H2.11 R30.2 R31.2 R36.2 R37.2 U1.2 U1.3 U1.20 U1.46 U1.55 U1.56 U5.2 U5.4
VDD_SPI: C2.2 C29.2 U1.29 U2.8
DTR: Q6.2 R10.2 U4.13
EN: C24.1 Q1.3 R30.1 RST.1 U1.4
IO0: BOOT.1 C26.2 Q6.3 R31.1 U1.5
IO1: H1.1 U1.6
IO2: H1.2 U1.7
IO3: H1.3 U1.8
IO4: H1.4 U1.9
IO5: H1.5 U1.10
IO6: H1.6 U1.11
IO7: H1.7 U1.12
IO8: H1.8 U1.13
IO9: H1.9 U1.14
IO10: H1.10 U1.15
IO11: H1.11 U1.16
IO12: H1.12 U1.17
IO13_LED: R35.2 U1.18
IO14_CS: FPC1.8 U1.19
IO15_DC: FPC1.6 U1.21
IO16_SDA: FPC1.5 U1.22
IO17_SCL: FPC1.4 U1.23
IO18_RST: FPC1.3 U1.24
IO19: OTG.A7 OTG.B7 U1.25
IO20: OTG.A6 OTG.B6 U1.26
IO27_WS: U1.27 WS.3
IO38: H2.7 U1.43
IO39: H2.6 U1.44
IO40: H2.5 U1.45
IO41: H2.4 U1.47
IO42: H2.3 U1.48
IO45: H2.2 U1.51
IO46: H2.1 U1.52
IO47: H2.8 U1.37
IO48: H2.9 U1.36
RTS: Q1.2 R11.2 U4.14
RXD0: R26.2 U1.50
SPICLK: U1.33 U2.6
SPICS0: U1.32 U2.1
SPID: U1.35 U2.5
SPIHD: U1.30 U2.7
SPIQ: U1.34 U2.2
SPIWP: U1.31 U2.3
TXD0: R27.2 TX.1 U1.49
USB1_CC1: R16.2 TTL.B5
USB1_CC2: R15.1 TTL.A5
USB2_CC1: OTG.B5 R29.2
USB2_CC2: OTG.A5 R28.2
USB_DN: TTL.A7 TTL.B7 U4.6
USB_DP: TTL.A6 TTL.B6 U4.5
XTAL_N: C4.1 U1.53 X1.3
XTAL_P: C3.2 U1.54 X1.1
$1N1315: R1.2 R2.2 U1.1
$1N1324: R1.1 R3.2 R4.2 U3.2
$1N1499: R4.1 R5.1
$1N3141: R26.1 U4.2
$1N3142: R27.1 U4.3
$1N3147: C21.2 U4.4
$1N3183: Q1.1 R10.1
$1N3184: Q6.1 R11.1
$1N4334: PWR.2 R37.1
$1N4335: R36.1 TX.2
$1N4336: IO13.2 R35.1

Pads without a net: OTG A8 B8; TTL A8 B8; U1 28 38 39 40 41 42; U3 1; U4 7 8 9 10 11 12 15; WS 1

## Via types
v1: diameter 0.61, hole 0.305, Top Layer to Bottom Layer, 121 vias

## Routing (per net, layer and track width the routed paths; a pad name or vN(x,y) marks a point on that pad's centre or on a via; arc(x,y) is an arc through that point)
+5V: length 70.9
  Top Layer w0.5: v1(25.53,34.47) 23.5,34.47 22.82,35.15 WS.4 ; 14.48,8.69 15.11,9.33 15.11,15.8 14.35,16.57 12.45,16.57 11.9,17.11 C11.1 ; 14.48,8.69 14.22,8.44 ; 14.48,8.69 14.56,8.61 25.74,8.61
  PWR w0.5: H2.10 34.56,27.74 33.6,28.71 33.6,30.31 32.61,31.3 v1(30.99,31.3) 30.99,33.26 29.77,34.47 v1(25.53,34.47) 25.55,34.45 25.55,32.82 23.77,31.04 13.48,31.04 11.3,28.87 v1(11.3,21.01)
GND: length 9
  Top Layer w0.254: C7.1 v1(16.37,38.03) ; X1.4 22.82,50.26 X1.2 ; X1.4 20.82,51.65 C3.1 ; X1.4 21.37,52.2 21.37,53.69 21.58,53.9 22.31,53.9
  vias: v1(4.07,56.79) v1(4.07,54.79) v1(4.07,52.79) v1(4.07,10.79) v1(4.07,8.79) v1(4.07,6.79) v1(4.07,4.79) v1(6.07,58.99) v1(6.07,57.99) v1(6.07,57) v1(6.07,55.99) v1(6.07,54.99) v1(6.07,52.79) v1(7.07,54.99) v1(8.07,54.99) v1(8.07,52.79) v1(9.07,54.99) v1(10.07,54.99) v1(10.07,50.79) v1(10.07,48.79) v1(10.57,12.39) v1(11.07,54.99) v1(12.07,54.99) v1(13.07,54.99) v1(13.57,12.39) v1(15.07,54.99) v1(16.07,54.99) v1(17.07,54.99) v1(18.17,54.99) v1(19.27,54.99) v1(19.87,58.89) v1(19.87,57.99) v1(19.87,56.99) v1(19.87,55.99) v1(23.03,27.39) v1(23.03,26.47) v1(26.87,12.39) v1(27.69,35.56) v1(28.57,46.29) v1(28.56,43.46) v1(28.57,42.49) v1(28.92,35.56) v1(29.78,12.39) v1(29.84,46.29) v1(29.86,43.46) v1(29.86,42.49) v1(30.07,58.79) v1(30.07,56.79) v1(30.07,54.79) v1(30.07,38.79) v1(30.12,35.56) v1(31.49,35.56) v1(32.07,58.79) v1(32.07,56.79) v1(32.07,54.79) v1(32.07,38.79) v1(34.07,58.79) v1(34.07,56.79) v1(34.07,54.79) v1(36.07,58.79) v1(36.07,56.79) v1(36.07,54.79) v1(36.07,28.79) v1(36.07,26.79) v1(36.07,10.79) v1(36.07,8.79) v1(36.07,6.79) v1(36.07,3.19)
VCC: length 110
  Top Layer w0.254: U1.20 19.44,39.24 19.48,39.2 19.48,38.66 18.85,38.03 C7.2 18.32,37.43 18.16,37.27 v1(16.27,37.27) ; C8.2 21.44,48.17 U1.46
  Top Layer w0.3: R31.2 33.95,18.11 v1(33.95,20.21) ; R30.2 5.96,18.1 v1(5.96,20.39) ; C8.2 21.43,48.49 21.73,48.79 25.36,48.79 25.8,49.23 v1(25.8,50.04)
  PWR w0.254: v1(12.2,33.08) 12.56,33.44 15.66,33.44 16.27,34.05 v1(16.27,37.27)
  PWR w0.3: v1(5.96,20.39) 13.55,20.39 14.22,21.07 v1(14.22,25.13) ; v1(18.8,20.25) 18.84,20.21 v1(33.95,20.21) 33.95,24.6 34.55,25.2 H2.11 ; v1(25.8,50.04) 17.01,50.04 v1(17,50.03) 16.98,50.04 12.45,50.04 11.67,49.26 v1(11.67,45.18) 11.67,38.32 12.75,37.24 16.24,37.24 v1(16.27,37.27) 16.46,37.08 22.68,37.08 23.45,37.84 v1(23.45,39.36)
  Bottom Layer w0.254: v1(23.45,39.36) 22.43,39.36 21.93,38.87 C28.2 ; FPC1.7 18.82,35.8 18.83,35.79 18.83,35.54 18.65,35.36 18.35,35.36 17.89,35.82 16.74,35.82 16.27,36.29 v1(16.27,37.27)
  Bottom Layer w0.3: FPC1.1 21.82,37.52 21.93,37.64 C28.2
  vias: v1(14.22,26.47) v1(15.24,26.47) v1(15.24,25.08) v1(18.29,21.52)
VDD_SPI: length 12.7
  Top Layer w0.3: U2.8 33.4,46.16 v1(33.66,46.41)
  PWR w0.3: v1(33.66,46.41) 33.66,40.31 33.27,39.93 v1(28.45,39.93)
DTR: length 24.8
  Top Layer w0.254: U4.13 29.21,22.66 27.66,24.22 27.66,27.14 26.8,28 18.92,28 18.34,28.58 R10.2 18.34,31.76 18.59,32.01 22.54,32.01 22.79,31.76 22.79,31.2
EN: length 52.2
  Top Layer w0.254: Q1.3 18.41,34.47 18.03,34.85 v1(10.67,34.85) ; v1(17.47,45.52) 17.47,44.92 17.09,44.53 16.66,44.53 U1.4 ; v1(6.86,19.61) 6.86,18.13 R30.1 6.82,16.63 RST.1 6.96,16.44 4.19,16.44 3.81,16.06 C24.1
  Bottom Layer w0.254: v1(17.47,45.52) 16.89,44.94 16.89,40.91 13.5,37.52 11.18,37.52 10.67,37.01 v1(10.67,34.85) 7.24,34.85 6.86,34.47 v1(6.86,19.61)
IO0: length 52.7
  Top Layer w0.254: v1(13.97,35.74) 21.21,35.74 21.72,35.23 Q6.3 21.74,33.08 32.13,33.08 33.06,32.15 R31.1 33.06,16.63 ; 33.06,16.63 33.25,16.44 35.69,16.44 35.94,16.18 C26.2 ; 33.06,16.63 BOOT.1 ; U1.5 16.66,44.13 17.09,44.13 17.12,44.1 v1(17.47,44.1)
  Bottom Layer w0.254: v1(13.97,35.74) 13.97,37.49 17.47,41 v1(17.47,44.1)
IO1: length 20.7
  Top Layer w0.254: U1.6 16.5,43.76 16.48,43.78 16.19,43.78 16.03,43.94 16.03,44.23 v1(15.75,44.51)
  Bottom Layer w0.254: H1.1 2.22,50.92 7.43,50.92 8,50.35 8,45.14 8.64,44.51 v1(15.75,44.51)
IO2: length 18.4
  Top Layer w0.254: U1.7 15.78,43.36 v1(15.57,43.57)
  Bottom Layer w0.254: v1(15.57,43.57) 8.43,43.57 7.65,44.35 7.65,47.53 6.86,48.32 H1.2
IO3: length 18.4
  Top Layer w0.254: H1.3 6.35,45.78 7.24,44.89 7.24,42.47 8.38,41.33 13.34,41.33 14.96,42.96 U1.8
IO4: length 16.1
  Top Layer w0.254: U1.9 16.62,42.53 15.08,42.53 13.5,40.95 8.13,40.95 5.84,43.24 H1.4
IO5: length 15.2
  Top Layer w0.254: H1.5 2.29,40.57 13.62,40.57 15.19,42.13 16.62,42.13 U1.10
IO6: length 16
  Top Layer w0.254: H1.6 7.77,38.16 8.92,39.3 12.85,39.3 15.29,41.73 16.62,41.73 U1.11
IO7: length 16.9
  Top Layer w0.254: H1.7 2.29,35.74 5.86,35.74 9.04,38.92 12.98,38.92 15.41,41.36 U1.12
IO8: length 19.5
  Top Layer w0.254: H1.8 6.73,33.08 7.31,33.66 7.31,36.69 9.19,38.56 13.13,38.56 15.5,40.93 16.62,40.93 U1.13
IO9: length 21.8
  Top Layer w0.254: H1.9 6.99,30.54 7.67,31.22 7.67,36.54 9.34,38.21 13.27,38.21 15.63,40.57 16.62,40.57 U1.14
IO10: length 24.5
  Top Layer w0.254: U1.15 15.32,39.75 13.42,37.85 9.48,37.85 8.03,36.39 8.03,28.91 7.11,28 H1.10
IO11: length 27.8
  Top Layer w0.254: H1.11 7.37,25.46 8.38,26.47 8.38,36.25 9.63,37.5 13.57,37.5 15.46,39.39 16.98,39.39 17.23,39.14 17.66,39.14 17.82,39.3 17.82,39.73 U1.16
IO12: length 30.8
  Top Layer w0.254: U1.17 18.24,39.17 17.86,38.78 15.36,38.78 13.72,37.14 9.78,37.14 8.76,36.12 8.76,23.55 8.13,22.92 H1.12
IO13_LED: length 24.9
  Top Layer w0.254: v1(18.9,38.96) 18.64,39.21 U1.18 ; 22.73,19.03 v1(21.84,19.03)
  GND w0.254: v1(21.84,19.03) 21.84,38.92 21.46,39.3 19.24,39.3 v1(18.9,38.96)
IO14_CS: length 5.3
  Top Layer w0.254: v1(19.05,40.7) 19.05,39.75 U1.19
  Bottom Layer w0.254: v1(19.05,40.7) 18.32,39.96 FPC1.8
IO15_DC: length 3.4
  Top Layer w0.254: U1.21 19.84,38.19 v1(19.34,37.68)
  Bottom Layer w0.254: v1(19.34,37.68) 19.34,37.44 19.39,37.39 19.39,36.72 FPC1.6
IO16_SDA: length 3.4
  Top Layer w0.254: U1.22 20.27,39.73 20.27,39.3 20.43,39.14 v1(20.43,38.66)
  Bottom Layer w0.254: v1(20.43,38.66) 20.45,38.65 20.45,38.25 20.34,38.14 20.34,37.86 19.89,37.4 19.89,36.72 FPC1.5
IO17_SCL: length 22
  Top Layer w0.254: U1.23 20.64,40.39 v1(20.83,40.57)
  Bottom Layer w0.254: v1(20.83,40.57) 24.61,40.57 24.87,40.31 24.87,32.59 24.27,31.99 20.67,31.99 20.32,32.34 FPC1.4
IO18_RST: length 3.2
  Top Layer w0.254: U1.24 21.04,38.02 v1(20.93,37.9)
  Bottom Layer w0.254: FPC1.3 20.89,36.72 20.89,37.39 20.93,37.43 v1(20.93,37.9)
IO19: length 47.4
  Top Layer w0.124: 12.06,8.25 12.06,8.44 11.81,8.69 11.3,8.69 11.06,8.45 OTG.B7 ; 12.06,8.25 12.14,8.33 12.14,9.46 arc(12.11,9.53) 12.04,9.56 arc(11.97,9.59) 11.94,9.66 11.94,9.96 arc(11.97,10.03) 12.04,10.06 arc(12.11,10.09) 12.14,10.16 12.14,10.46 arc(12.11,10.53) 12.04,10.56 arc(11.97,10.59) 11.94,10.66 11.94,10.96 arc(11.97,11.03) 12.04,11.06 arc(12.11,11.09) 12.14,11.16 12.14,11.46 arc(12.11,11.53) 12.04,11.56 arc(11.97,11.59) 11.94,11.66 11.94,11.96 arc(11.97,12.03) 12.04,12.06 arc(12.11,12.09) 12.14,12.16 12.14,12.46 arc(12.11,12.53) 12.04,12.56 arc(11.97,12.59) 11.94,12.66 11.94,12.96 arc(11.97,13.03) 12.04,13.06 arc(12.11,13.09) 12.14,13.16 12.14,14.66 9.62,17.19 9.62,35.41 10.93,36.72 20.83,36.72 21.49,37.37 21.49,38.99 21.48,39 21.48,39.26 21.44,39.29 U1.25 ; 12.06,8.25 12.06,8.24 OTG.A7
IO20: length 47.4
  Top Layer w0.124: U1.26 21.84,39.29 21.81,39.26 21.81,39.13 21.81,39.13 21.81,37.24 20.97,36.39 11.06,36.39 9.95,35.27 9.95,17.32 12.47,14.8 12.47,8.33 12.56,8.24 OTG.B6 12.56,6.39 12.32,6.15 11.81,6.15 11.56,6.41 11.56,7.47
IO27_WS: length 1.9
  Top Layer w0.254: WS.3 22.82,38.7 22.24,39.28 U1.27
IO38: length 26.9
  Top Layer w0.254: U1.43 v1(22.64,44.29)
  Bottom Layer w0.254: v1(22.64,44.29) 22.86,44.51 25.27,44.51 25.68,44.91 35.41,44.91 35.81,44.51 35.81,36 36.45,35.36 H2.7
IO39: length 25.3
  Top Layer w0.254: H2.6 34.93,37.9 34.67,38.16 34.67,46.66 34.11,47.23 22.42,47.23 22.24,47.05 U1.44
IO40: length 23.5
  Top Layer w0.254: U1.45 21.84,47.3 22.18,47.64 34.33,47.64 35.05,46.92 35.05,41.08 35.69,40.44 H2.5
IO41: length 23.3
  Top Layer w0.254: v1(21.66,45.65) 21.36,45.95 21.23,45.95 21.16,46.02 21.16,46.02 21.07,46.11 21.07,46.54 U1.47
  Bottom Layer w0.254: v1(21.66,45.65) 36.19,45.65 37.21,46.66 38.86,46.66 39.42,46.1 39.42,44.3 H2.4
IO42: length 19.2
  Top Layer w0.254: v1(20.57,45.77) 20.57,46.07 20.62,46.11 20.62,46.54 U1.48
  Bottom Layer w0.254: H2.3 37.08,45.52 36.83,45.27 23.62,45.27 23.37,45.01 20.83,45.01 20.57,45.27 v1(20.57,45.77)
IO45: length 28.2
  Top Layer w0.254: v1(19.69,48.19) 19.44,47.95 U1.51
  Bottom Layer w0.254: v1(19.69,48.19) 25.78,48.19 26.82,49.23 26.82,50.24 28.33,51.74 38.99,51.74 39.5,51.24 39.5,48.44 39.12,48.06 H2.2
IO46: length 23.3
  Top Layer w0.254: U1.52 19.04,46.14 18.86,45.95 18.86,45.84 v1(18.67,45.65)
  Bottom Layer w0.254: H2.1 38.05,50.65 27.74,50.65 27.18,50.09 27.18,48.95 25.02,46.79 19.81,46.79 v1(18.67,45.65)
IO47: length 25.8
  Top Layer w0.254: U1.37 23.47,43.78 23.9,43.78 24.05,43.92 v1(24.26,43.92)
  Bottom Layer w0.254: v1(24.26,43.92) 25.32,43.92 25.91,44.51 34.93,44.51 35.43,44 35.43,33.71 36.32,32.82 H2.8
IO48: length 29.8
  Top Layer w0.254: U1.36 23.43,43.38 23,43.38 22.85,43.53 v1(22.61,43.53)
  Bottom Layer w0.254: H2.9 36.07,30.28 35.05,31.3 35.05,43.62 34.54,44.12 26.03,44.12 25.27,43.36 24.52,43.36 24.5,43.34 24.02,43.34 23.99,43.36 23.62,43.36 23.46,43.53 v1(22.61,43.53)
RTS: length 16.9
  Top Layer w0.254: U4.14 28.7,23.93 28.19,24.44 28.19,27.36 27.02,28.53 20.29,28.53 19.76,29.06 19.76,29.77 R11.2 19.76,30.08 19.37,30.47 19.37,31.2
RXD0: length 28.9
  Top Layer w0.254: R26.2 21.21,25.2 20.57,25.84 v1(20.57,26.34) ; U1.50 19.82,46.54 19.82,45.79 v1(19.81,45.78)
  Bottom Layer w0.254: v1(19.81,45.78) 18.41,44.38 18.41,40.93 14.93,37.45 14.93,32.24 15.62,31.55 19.18,31.55 20.57,30.15 v1(20.57,26.34)
SPICLK: length 11.9
  Top Layer w0.254: v1(22.61,41.9) 22.77,41.9 23.03,42.16 U1.33 ; U2.6 32.51,43.58 32.51,43.11 32.38,42.98 v1(31.62,42.98)
  Bottom Layer w0.254: v1(22.61,41.9) 30.54,41.9 v1(31.62,42.98)
SPICS0: length 6.9
  Top Layer w0.254: U1.32 23.47,41.78 24.38,41.78 25.02,42.41 25.02,45.9 25.27,46.16 U2.1
SPID: length 14.3
  Top Layer w0.254: v1(32.51,41.58) 32.51,42.31 U2.5 ; v1(22.61,42.66) 22.69,42.66 23,42.98 23.43,42.98 U1.35
  Bottom Layer w0.254: v1(32.51,41.58) 32.38,41.58 32.08,41.28 22.07,41.28 21.9,41.46 21.9,42.4 22.16,42.66 v1(22.61,42.66)
SPIHD: length 14.7
  Top Layer w0.254: 32.48,44.89 33.27,44.89 33.53,44.63 33.53,41.33 33.15,40.96 U1.30
SPIQ: length 6.7
  Top Layer w0.254: v1(27.31,42.9) 27.31,42.9 27.31,43.32 27.37,43.38 27.37,43.85 27.31,43.92 27.31,44 27.05,44.25 26.54,44.25 26.45,44.34 26.45,44.89 ; U1.34 24.26,42.56 v1(24.34,42.64)
  Bottom Layer w0.254: v1(24.34,42.64) 27.05,42.64 v1(27.31,42.9)
SPIWP: length 4.8
  Top Layer w0.254: U1.31 24.79,41.36 25.4,41.97 25.4,43.36 25.65,43.62 U2.3
TXD0: length 43.7
  Top Layer w0.254: v1(20.19,47.43) 20.22,47.4 20.22,46.58 U1.49 ; TX.1 20.16,14.66 20.96,14.66 21.21,14.91 21.21,19.61 22.05,20.45 R27.2 20.83,23.93 19.81,24.95 v1(19.81,26.34)
  Bottom Layer w0.254: v1(19.81,26.34) 19.81,30.28 18.92,31.17 15.5,31.17 14.58,32.09 14.58,37.59 18.06,41.08 18.06,46.28 19.2,47.43 v1(20.19,47.43)
USB1_CC1: length 2.1
  Top Layer w0.254: 29.8,7.47 29.8,9.5 29.77,9.53
USB1_CC2: length 2.1
  Top Layer w0.254: 26.8,7.47 26.8,9.53
USB2_CC1: length 2.1
  Top Layer w0.254: OTG.B5 13.56,9.48 13.5,9.53
USB2_CC2: length 2.1
  Top Layer w0.254: 10.58,9.53 10.56,9.5 OTG.A5
USB_DN: length 20.5
  Top Layer w0.124: TTL.A7 28.3,8.24 ; 28.3,8.24 28.38,8.33 28.38,9.03 arc(28.32,9.18) 28.16,9.25 arc(28,9.31) 27.94,9.47 27.94,9.53 arc(28,9.68) 28.16,9.75 arc(28.32,9.81) 28.38,9.97 28.38,10.03 arc(28.32,10.18) 28.16,10.25 arc(28,10.31) 27.94,10.47 27.94,10.53 arc(28,10.68) 28.16,10.75 arc(28.32,10.81) 28.38,10.97 28.38,11.03 arc(28.32,11.18) 28.16,11.25 arc(28,11.31) 27.94,11.47 27.94,11.53 arc(28,11.68) 28.16,11.75 arc(28.32,11.81) 28.38,11.97 28.38,20.1 27.96,20.53 25.48,20.53 25.41,20.59 25.28,20.59 U4.6 ; 28.3,8.24 28.3,8.46 28.07,8.69 27.56,8.69 27.3,8.43 TTL.B7
USB_DP: length 20.5
  Top Layer w0.124: U4.5 25.28,20.92 25.54,20.92 25.61,20.85 28.1,20.85 28.71,20.24 28.71,8.33 28.8,8.24 28.8,6.37 28.57,6.15 28.07,6.15 27.81,6.41 27.81,7.45 27.8,7.47
XTAL_N: length 15.5
  Top Layer w0.254: v1(18.67,53.97) 20.34,53.97 21.17,54.79 23.17,54.79 23.41,54.55 C4.1 23.41,52.04 X1.3 ; U1.53 18.64,47.28 19.05,47.68 v1(19.05,48.95)
  Bottom Layer w0.254: v1(18.67,53.97) 18.67,49.33 v1(19.05,48.95)
XTAL_P: length 6.7
  Top Layer w0.254: X1.1 20.03,50.26 19.69,50.6 18.96,50.6 18.92,50.56 18.92,49.84 18.22,49.14 18.22,46.54
$1N1315: length 5.7
  Top Layer w0.2: U1.1 16.62,45.78 14.73,45.78 14.29,46.22 R2.2
  Top Layer w0.254: R2.2 14.3,47.86 R1.2
$1N1324: length 7.6
  Top Layer w0.254: 14.41,57.84 14.29,57.72 R4.2 R3.2 14.3,51.73 R1.1
$1N1499: length 1.8
  Top Layer w0.254: R4.1 11.68,53.78 R5.1
$1N3141: length 1.9
  Top Layer w0.254: U4.2 R26.1
$1N3142: length 1.9
  Top Layer w0.254: U4.3 R27.1
$1N3147: length 1.9
  Top Layer w0.254: U4.4 24.78,22.62 22.93,22.62
$1N3183: length 1.4
  Top Layer w0.254: Q1.1 17.47,31.19 R10.1
$1N3184: length 1.5
  Top Layer w0.254: R11.1 20.63,30.21 20.89,30.47 20.89,31.2
$1N4334: length 1.8
  Top Layer w0.254: R37.1 17.4,16.35 PWR.2
$1N4335: length 1.8
  Top Layer w0.254: R36.1 20.07,16.35 TX.2
$1N4336: length 1.8
  Top Layer w0.254: R35.1 22.73,16.35 IO13.2

## Copper pours and planes (outline as drawn; the poured copper is in the pictures)
+5V on Top Layer: 9.11,8.13 9.11,6.7 9.4,6.41 9.4,5.39 10.03,4.75 13.97,4.75 13.97,5.96 14.51,6.82 14.51,8.78 13.87,8.78 13.87,6.75 13.09,5.9 10.29,5.9 9.78,6.41 9.78,8.06 9.65,8.18 9.6,8.13
+5V on Top Layer: 10.29,23.04 10.29,19.36 10.92,18.72 10.92,17.2 11.18,16.95 12.32,16.95 12.32,21.07 12.79,21.07 13.21,21.49 13.21,23.04 13.2,23.04
+5V on Top Layer: 14.6,9.83 16.64,9.83 16.64,8.31 14.6,8.31
+5V on Top Layer: 25.35,9.15 25.35,6.65 25.64,6.36 25.64,5.34 26.27,4.71 30.21,4.71 30.21,5.91 30.75,6.77 30.75,8.1 30.11,8.1 30.11,6.7 29.33,5.85 26.53,5.85 26.02,6.47 26.02,9.15
+5V on Top Layer: 30.35,32.06 30.35,27.31 29.77,26.73 29.59,26.73 29.59,25.84 31.62,25.84 31.75,25.96 31.75,32.13 30.42,32.13
GND on Top Layer: -4.53,63.62 47.7,63.62 47.7,-3.2 -4.53,-3.2
GND on Bottom Layer: -5.68,62.52 46.55,62.52 46.55,-4.3 -5.68,-4.3
GND on GND: -5.75,62.57 46.48,62.57 46.48,-4.25 -5.75,-4.25
GND on PWR: -5.92,62.57 46.31,62.57 46.31,-4.25 -5.92,-4.25
VCC on Top Layer: 18.06,46.28 16.44,46.28 16.39,46.34 16.39,50.42 16.48,50.51 17.79,50.51 17.92,50.38 17.92,47.15 18.06,46.91 18.06,46.29
VCC on Top Layer: 13.21,25.07 13.34,25.2 13.34,27.73 12.94,28.12 10.92,28.12 10.92,33.45 12.7,33.45 12.7,31.07 13.91,29.86 13.91,29.65 14.48,29.07 14.48,27.64 14.89,27.64 15.85,26.68 17.7,26.68 17.78,26.6 18.54,26.6 18.92,26.22 18.92,23.51 20.79,18.6 16.76,18.6 15.75,22.03 14.35,23.42 10.41,23.42 10.16,23.68 10.16,25.07
VCC on Top Layer: 10.81,45.55 17.01,45.55 17.07,45.5 17.07,44.83 17.04,44.8 16.3,44.8 16.24,44.86 15.57,44.86 15.22,44.51 10.81,44.51
VDD_SPI on Top Layer: 23.12,40.66 29.21,40.66 29.21,39.3 24.77,39.3 24.64,39.43 24.64,40.19 24.51,40.31 23.24,40.31 23.06,40.5 23.06,40.57 23.12,40.63

## Text on the board
Bottom Silkscreen Layer: IO1 | IO2 | IO3 | IO4 | IO5 | IO6 | IO7 | IO8 | IO9 | IO10 | IO11 | IO12 | IO46 | IO45 | IO42 | IO41 | IO40 | IO39 | IO38 | IO47 | IO48 | 5V | 3V3 | GND | esp32s3 mini / system v1.0 | 1
Top Silkscreen Layer: Author: | myry
